# Altium schematic sheet RMP_MAIN_HFB.SchDoc
size A; SheetNumber: 3; SheetTotal: 7
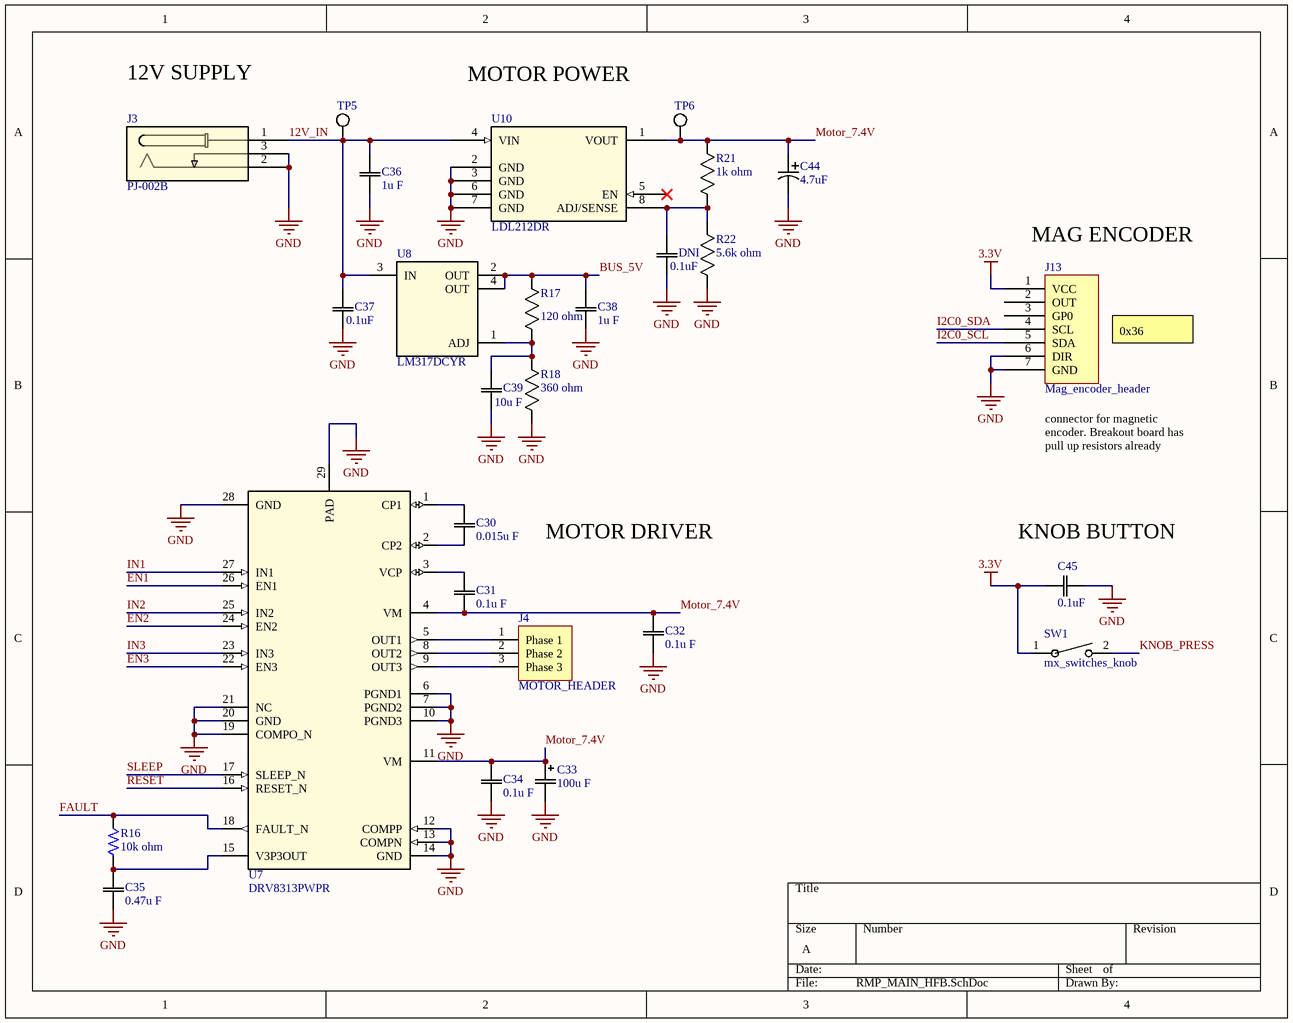
[diagram p0: RMP_MAIN_HFB.SchDoc]

## Parts
C30  value 0.015u F  [CC0805N_YAG-M]  (hidden comment: CC0805KRX7R9BB153)
C31  value 0.1u F  [CC0805N_YAG-M]  (hidden comment: CC0805KRX7R9BB104)
C32  value 0.1u F  [CC0805N_YAG-M]  (hidden comment: CC0805KRX7R9BB104)
C33  value 100u F  [CAP_YX_6P3X11_RUB]  (hidden comment: 35YXJ100M6.3X11)
C34  value 0.1u F  [CC0805N_YAG-M]  (hidden comment: CC0805KRX7R9BB104)
C35  value 0.47u F  [CC0805N_YAG-M]  (hidden comment: CC0805KKX7R8BB474)
C36  value 1u F  [CAP_CL21B105KAFNNNE_SAM-M]  (hidden comment: CL21B105KAFNNNE)
C37  value 0.1uF  [CC0805N_YAG-M]  (hidden comment: CC0805KRX7R9BB104)
C38  value 1u F  [CAP_CL21B105KAFNNNE_SAM-M]  (hidden comment: CL21B105KAFNNNE)
C39  value 10u F  [G-21_MUR-M]  (hidden comment: GRM21BR61C106KE15K)
C44  value 4.7uF  [TAJA_AVX-M]  (hidden comment: TAJA475K016RNJ)
C45  value 0.1uF  [CC0805N_YAG-M]  (hidden comment: CC0805KRX7R9BB104)
DNI  value 0.1uF  [CC0805N_YAG-M]  (hidden comment: CC0805KRX7R9BB104)
J3  PJ-002B  [PJ-002B_CUI]
J4  MOTOR_HEADER  [3PINHEADER]
J13  Mag_encoder_header  [8PinHeader]
R16  value 10k ohm  [STA_RNCP0805_STP-M]  (hidden comment: RNCP0805FTD10K0)
R17  value 120 ohm  [RES_RNCF0805_STP-M]  (hidden comment: RNCF0805DTE120R)
R18  value 360 ohm  [RES_RNCF0805_STP-M]  (hidden comment: RNCF0805DTE360R)
R21  value 1k ohm  [RES_RNCF0805_STP-M]  (hidden comment: RNCF0805DTE1K00)
R22  value 5.6k ohm  [RES_RNCF0805_STP-M]  (hidden comment: RNCF0805DTE5K60)
SW1  mx_switches_knob  [knob_switches]
TP5  TestPoint  [Testpoint]  (value not drawn)
TP6  TestPoint  [Testpoint]  (value not drawn)
U7  DRV8313PWPR  [PWP0028F_M]
U8  LM317DCYR  [DCY0004A_M]
U10  LDL212DR  [SO8B_4X5X1P27_STM]

## Nets
3.3V: C45.2 J13.1(VCC) SW1.1
GND: C32.1 C33.2 C34.1 C35.1 C36.1 C37.1 C38.1 C39.1 C44.2 C45.1 DNI.1 J3.2 J3.3 J13.6(DIR) J13.7(GND) R18.1 R22.1 U7.6(PGND1) U7.7(PGND2) U7.10(PGND3) U7.12(COMPP) U7.13(COMPN) U7.14(GND) U7.19(COMPO_N) U7.20(GND) U7.21(NC) U7.28(GND) U7.29(PAD) U10.2(GND) U10.3(GND) U10.6(GND) U10.7(GND)
12V_IN: C36.2 C37.2 J3.1 TP5.1 U8.3(IN) U10.4(VIN)
BUS_5V: C38.2 R17.2 U8.2(OUT) U8.4(OUT)
EN1: U7.26(EN1)
EN2: U7.24(EN2)
EN3: U7.22(EN3)
FAULT: R16.2 U7.18(FAULT_N)
I2C0_SCL: J13.5(SDA)
I2C0_SDA: J13.4(SCL)
IN1: U7.27(IN1)
IN2: U7.25(IN2)
IN3: U7.23(IN3)
KNOB_PRESS: SW1.2
Motor_7.4V: C31.1 C32.2 C33.1 C34.2 C44.1 R21.2 TP6.1 U7.4(VM) U7.11(VM) U10.1(VOUT)
RESET: U7.16(RESET_N)
SLEEP: U7.17(SLEEP_N)
NetC30_1: C30.1 U7.2(CP2)
NetC30_2: C30.2 U7.1(CP1)
NetC31_2: C31.2 U7.3(VCP)
NetC35_2: C35.2 R16.1 U7.15(V3P3OUT)
NetC39_2: C39.2 R17.1 R18.2 U8.1(ADJ)
NetDNI_2: DNI.2 R21.1 R22.2 U10.8(ADJ/SENSE)
NetJ4_1: J4.1(Phase_1) U7.5(OUT1)
NetJ4_2: J4.2(Phase_2) U7.8(OUT2)
NetJ4_3: J4.3(Phase_3) U7.9(OUT3)

Not connected (* = marked no-connect by the designer): J13 2(OUT) 3(GP0); U10 5(EN)*

## Notes on the sheet
- 12V SUPPLY
- (near U10) MOTOR POWER
- (near J13) MAG ENCODER
- 0x36
- (near J13) connector for magnetic encoder. Breakout board has pull up resistors already
- MOTOR DRIVER
- (near C45) KNOB BUTTON

## Library data of the parts
C30 = CAP_CC0805KRX7R9BB153: 0.015 µF ±10% 50V Ceramic Capacitor X7R 0805 (2012 Metric); Mfr_Name: Yageo
C31 C32 C34 C37 C45 DNI = CAP_CC0805KRX7R9BB104: 0.1 µF ±10% 50V Ceramic Capacitor X7R 0805 (2012 Metric); Mfr_Name: Yageo
C33 = CAP_35YXJ100M6.3X11: CAP ALUM 100UF 20% 35V RADIAL TH; Mfr_Name: Rubycon
C35 = CAP_CC0805KKX7R8BB474: 0.47 µF ±10% 25V Ceramic Capacitor X7R 0805 (2012 Metric); Mfr_Name: Yageo
C36 C38 = CAP_CL21B105KAFNNNE: 1 µF ±10% 25V Ceramic Capacitor X7R 0805 (2012 Metric); Mfr_Name: Samsung
C39 = CAP_GRM21BR61C106KE15K: 10 µF ±10% 16V Ceramic Capacitor X5R 0805 (2012 Metric); Mfr_Name: Murata
C44 = CAP_TAJA475K016RNJ: 4.7 µF Molded Tantalum Capacitors 16 V 1206 (3216 Metric) 4Ohm; Mfr_Name: KYOCERA AVX
J3 = PJ-002B: Power Barrel Connector Jack 2.50mm ID (0.098"), 5.50mm OD (0.217") Through Hole, Right Angle; Mfr_Name: CUI Inc; RefDes: RefDes; Type: Type
J4 = MOTOR_HEADER: BLDC motor header
R16 = RES_RNCP0805FTD10K0: 10 kOhms ±1% 0.25W, 1/4W Chip Resistor 0805 (2012 Metric) Anti-Sulfur Thin Film; Supplier 1: Digikey; Supplier Part Number 1: RNCP0805FTD10K0CT-ND
R17 = RES_RNCF0805DTE120R: 120 Ohms ±0.5% 0.25W, 1/4W Chip Resistor 0805 (2012 Metric) Automotive AEC-Q200 Thin Film; Mfr_Name: Stackpole International
R18 = RES_RNCF0805DTE360R: 360 Ohms ±0.5% 0.25W, 1/4W Chip Resistor 0805 (2012 Metric) Automotive AEC-Q200 Thin Film; Mfr_Name: Stackpole International
R21 = RES_RNCF0805DTE1K00: 1 kOhms ±0.5% 0.25W, 1/4W Chip Resistor 0805 (2012 Metric) Automotive AEC-Q200 Thin Film; Mfr_Name: Stackpole International
R22 = RES_RNCF0805DTE5K60: 5.6 kOhms ±0.5% 0.25W, 1/4W Chip Resistor 0805 (2012 Metric) Automotive AEC-Q200 Thin Film; Mfr_Name: Stackpole International
SW1 = mx_switches_knob: No Description Available; Mfr_Name: Cherry
U7 = DRV8313PWPR: IC MOTOR DRIVER 8V-60V 28HTSSOP; Mfr_Name: Texas Instruments; TYPE: TYPE; RefDes: RefDes
U8 = LM317DCYR: Linear Voltage Regulator IC Positive Adjustable 1 Output 1.5A SOT-223-4; Mfr_Name: Texas Instruments; SymbolCreater: Altium; TYPE: TYPE; RefDes: RefDes; PartNumber: LM317DCYR; Alternate_PartNumber: LM317DCY; PackageReference: DCY0004A; MountType: SMT; CompType: IC; RoHS: Y; Manufacturer: Texas Instruments
U10 = LDL212DR: Linear Voltage Regulator IC Positive Adjustable 1 Output 1.2A 8-SO; Mfr_Name: STMicroelectronics; RefDes: RefDes; Type: Type